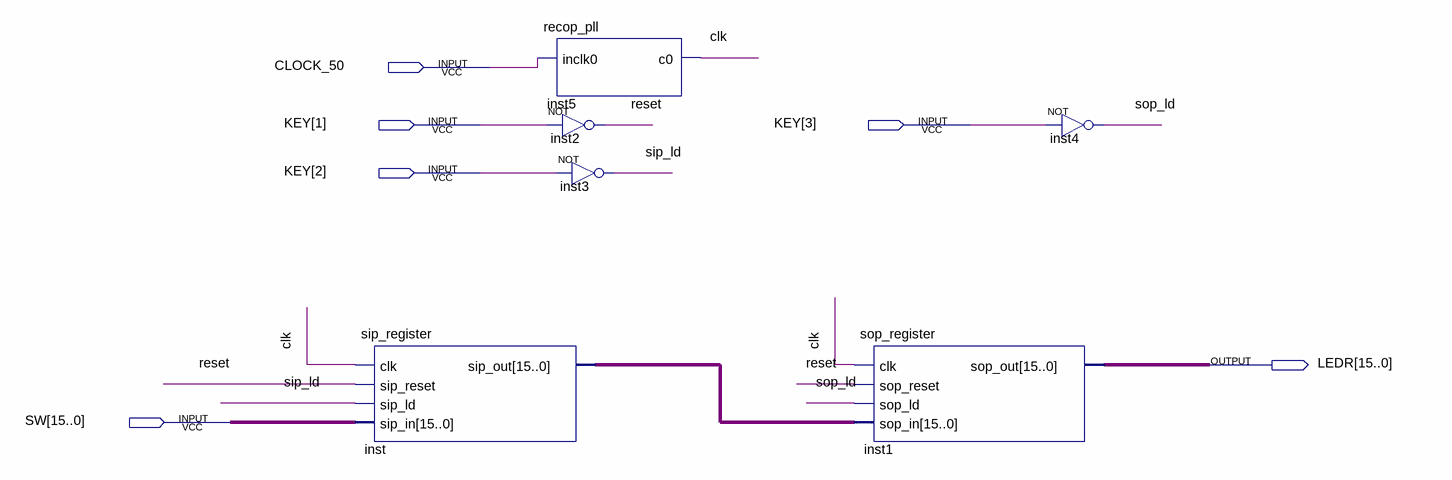
[diagram p0: schematic sheet]
// Quartus schematic SIP_SOP_TEST.bdf as structural Verilog: 6 symbols, 6 pins
module SIP_SOP_TEST (
  input  CLOCK_50,
  input  [3:1] KEY,
  input  [15:0] SW,
  output [15:0] LEDR
);

  wire clk, reset, sip_ld, sop_ld;
  wire [15:0] inst_sip_out;

  sip_register inst (.clk(clk), .sip_reset(reset), .sip_ld(sip_ld), .sip_in(SW), .sip_out(inst_sip_out));
  recop_pll inst5 (.inclk0(CLOCK_50), .c0(clk));
  not inst2 (reset, KEY[1]);
  not inst3 (sip_ld, KEY[2]);
  sop_register inst1 (.clk(clk), .sop_reset(reset), .sop_ld(sop_ld), .sop_in(inst_sip_out), .sop_out(LEDR));
  not inst4 (sop_ld, KEY[3]);
endmodule
